# EAGLE board BSB-to-PoELAN (EAGLE 6.6.0)
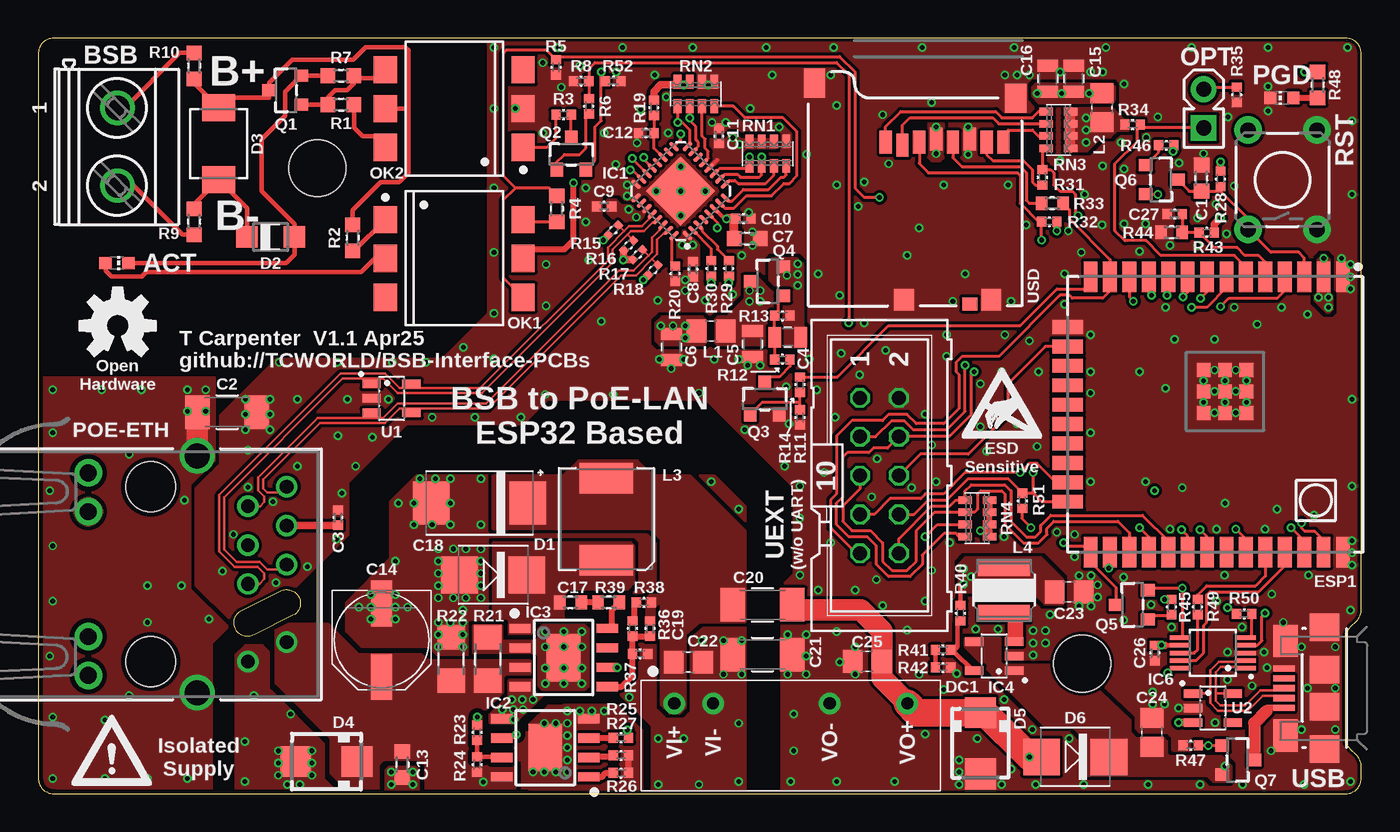
[diagram p4: board, top side]
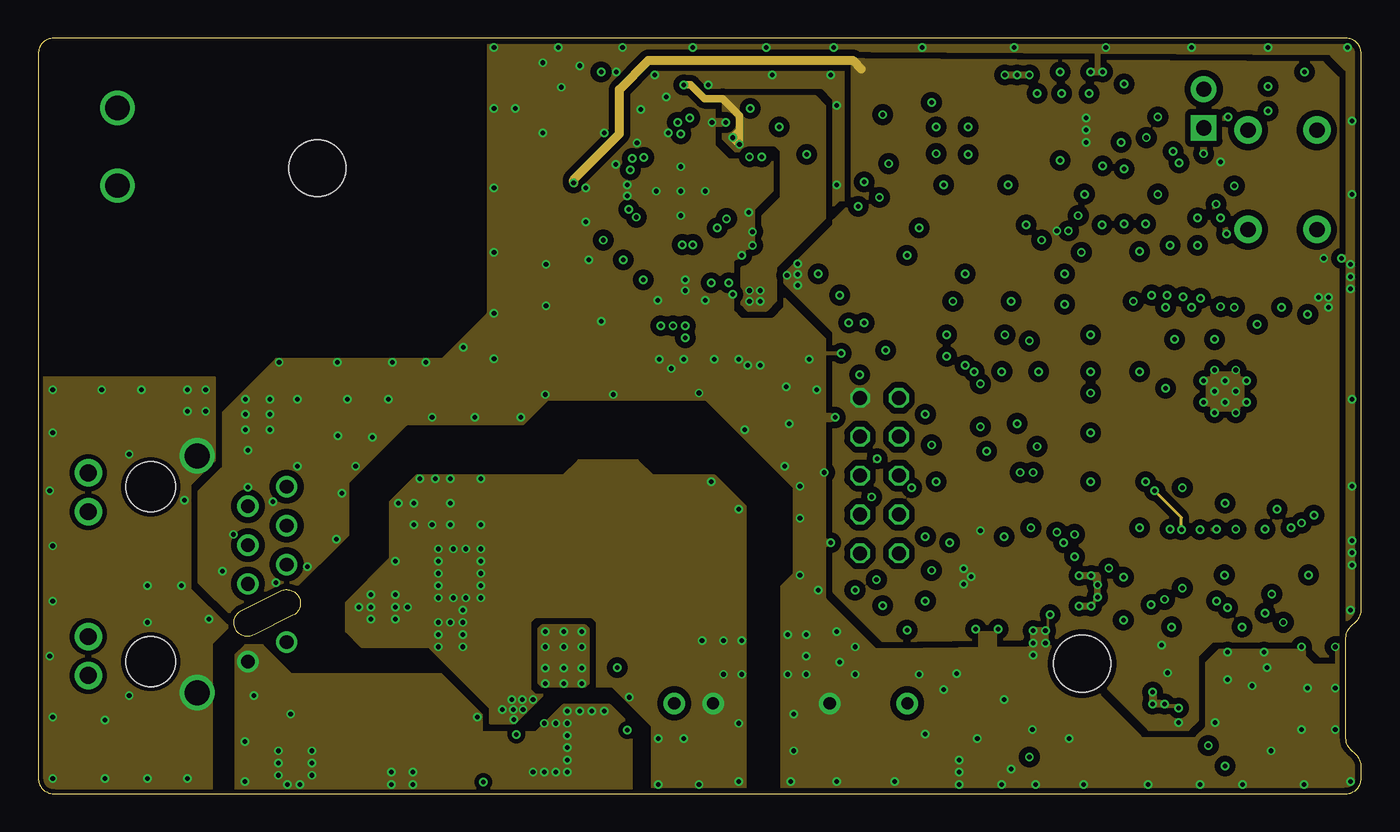
[diagram p5: board, inner layer Route2]
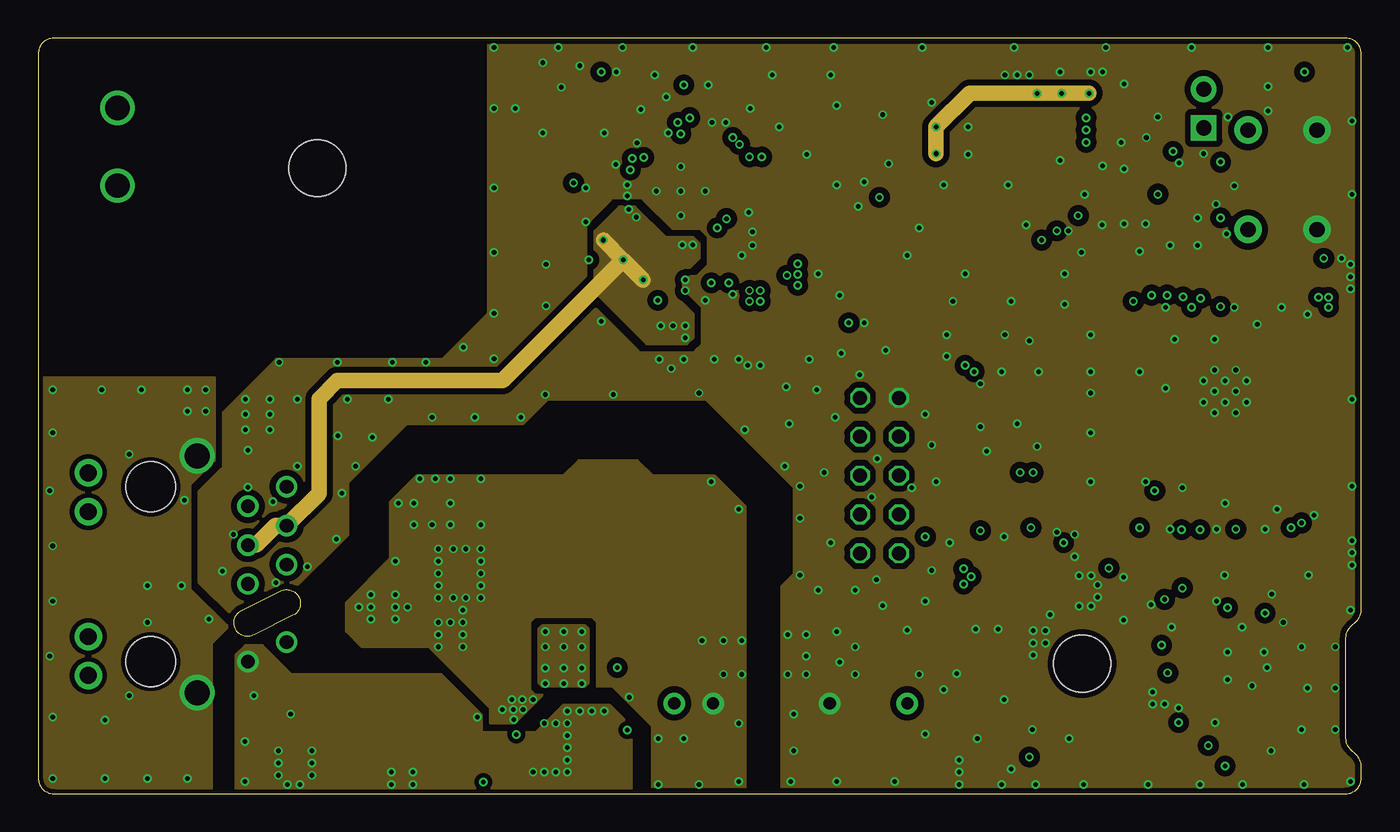
[diagram p6: board, inner layer Route15]
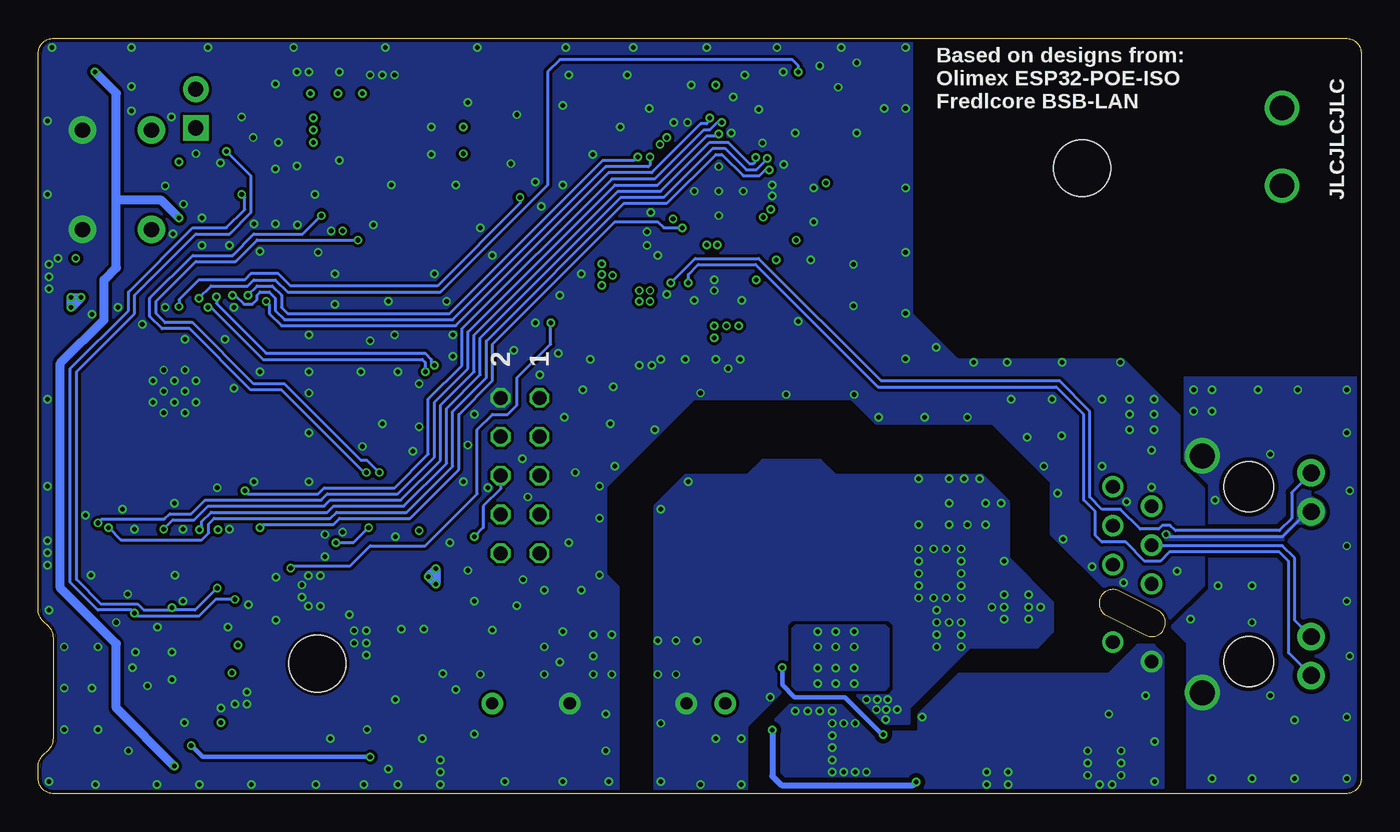
[diagram p7: board, bottom side, seen from below]

Size 86.5 x 49.4 mm. Coordinates in mm from the lower left corner, seen from the top.
Outline: 86.5,1 86.5,1.79 arc45 86.21,2.49 85.79,2.91 arc-45 85.5,3.61 85.5,10.19 arc-45 85.79,10.89 86.21,11.31 arc45 86.5,12.01 86.5,48.4 arc90 85.5,49.4 1,49.4 arc90 0,48.4 0,1 arc90 1,0 85.5,0 arc90 86.5,1
Copper layers (1+2*15+16): Top 0.035mm / dielectric 0.2mm / Route2 0.0175mm / dielectric 1.065mm / Route15 0.0175mm / dielectric 0.2mm / Bottom 0.035mm
Design rules "jlc4l-7628 *": minimum track width 0.12mm, minimum drill 0.2mm, track to track 0.125mm, track to pad 0.125mm, pad to pad 0.15mm, via to via 0.125mm, smd to smd 0mil, copper to edge 9mil, drill to drill 0.2mm, minimum pad ring 0.125mm, minimum via ring 0.125mm, stop-mask expansion 0.125mm, vias tented up to drill 1mm, thermal gap 6mil
Net classes: 1 100R: width 0.175 mm, drill 0.25 mm, clearance 0.15 mm; 2 PoE-ISO: clearance 2 mm to class 1; 3 B2B-ISO: clearance 2 mm to class 1, clearance 2 mm to class 2; 4 ESP32: clearance 2 mm to class 2, clearance 2 mm to class 3; 5 Sheild: clearance 1.5 mm to class 1, clearance 2 mm to class 2, clearance 2 mm to class 3, clearance 1.5 mm to class 4

## Footprints (pad centres in the part's own frame; a part is rotated, then mirrored left to right if it is on the bottom)
CHIP-LED0603 = smd 0.8 x 0.8: A 0,-0.75; C 0,0.75
MKDSN1_5-2-5_08 = drill 1.6: 1 -2.54,0.025; 2 2.54,0.025
C0603 = smd 0.95 x 1: 1 -0.85,0; 2 0.85,0
C1808 = smd 1.6 x 2.2: 1 -1.95,0; 2 1.95,0
C0402 = smd 0.6 x 0.65: 1 -0.5,0; 2 0.5,0
C0805L = smd 0.8 x 1.35: 1 -0.85,0; 2 0.85,0
PANASONIC_D = smd 3 x 1.4: + 2.4,0; - -2.4,0
C0603L = smd 0.75 x 0.9: 1 -0.7,0; 2 0.7,0
SMC_D = smd 2.4 x 2.8: + -3.15,0; - 3.15,0
C0805 = smd 1.3 x 1.5: 1 -0.95,0; 2 0.95,0
CNMB/3- = hole 3.7: 18.25,41.1; 68.25,8.7
SMB = smd 2.4 x 2.4: A 2.2,0; C -2.2,0
SOD123 = smd 1.4 x 1.4: A 1.55,0; C -1.55,0
SMBG = smd 1.78 x 2.16: 1 -2.35,0; 2 2.35,0
SMA = smd 2 x 2: A 2,0; C -2,0
SIP7-N = drill 0.8 pad 1.4: 1 -7.62,-0.5; 2 -5.08,-0.5; 5 2.54,-0.5; 7 7.62,-0.5
ESP32-WROOM-32UE = smd 2 x 0.9: 1 -9,16.51; 2 -9,15.24; 3 -9,13.97; 4 -9,12.7; 5 -9,11.43; 6 -9,10.16; 7 -9,8.89; 8 -9,7.62; 9 -9,6.35; 10 -9,5.08; 11 -9,3.81; 12 -9,2.54; 13 -9,1.27; 14 -9,0; 25 9,0; 26 9,1.27; 27 9,2.54; 28 9,3.81; 29 9,5.08; 30 9,6.35; 31 9,7.62; 32 9,8.89; 33 9,10.16; 34 9,11.43; 35 9,12.7; 36 9,13.97; 37 9,15.24; 38 9,16.51 | smd 0.9 x 2: 15 -5.715,-1.5; 16 -4.445,-1.5; 17 -3.175,-1.5; 18 -1.905,-1.5; 19 -0.635,-1.5; 20 0.635,-1.5; 21 1.905,-1.5; 22 3.175,-1.5; 23 4.445,-1.5; 24 5.715,-1.5 | smd 0.9 x 0.9: EP1 -1.5,8.79; EP2 -1.5,10.19; EP3 -0.1,10.19; EP4 -0.1,8.79; EP5 -0.1,7.39; EP6 -1.5,7.39; EP7 -2.9,7.39; EP8 -2.9,8.79; EP9 -2.9,10.19
QFN-5X5-32 = smd 0.75 x 0.25: 1 -2.375,1.75; 2 -2.375,1.25; 3 -2.375,0.75; 4 -2.375,0.25; 5 -2.375,-0.25; 6 -2.375,-0.75; 7 -2.375,-1.25; 8 -2.375,-1.75; 17 2.375,-1.75; 18 2.375,-1.25; 19 2.375,-0.75; 20 2.375,-0.25; 21 2.375,0.25; 22 2.375,0.75; 23 2.375,1.25; 24 2.375,1.75 | smd 0.25 x 0.75: 9 -1.75,-2.375; 10 -1.25,-2.375; 11 -0.75,-2.375; 12 -0.25,-2.375; 13 0.25,-2.375; 14 0.75,-2.375; 15 1.25,-2.375; 16 1.75,-2.375; 25 1.75,2.375; 26 1.25,2.375; 27 0.75,2.375; 28 0.25,2.375; 29 -0.25,2.375; 30 -0.75,2.375; 31 -1.25,2.375; 32 -1.75,2.375 | smd 3.2 x 3.2: EP 0,0
SOIC8-EP = smd 0.6 x 1.4: 1 -1.905,-2.85; 2 -0.635,-2.85; 3 0.635,-2.85; 4 1.905,-2.85; 5 1.905,2.85; 6 0.635,2.85; 7 -0.635,2.85; 8 -1.905,2.85 | smd 3.1 x 2.2: EP 0,0
DBV0005A-SOT23 = smd 0.55 x 1.2: 1 -0.95,-1.3; 2 0,-1.3; 3 0.95,-1.3; 4 0.95,1.3; 5 -0.95,1.3
MSOP10 = smd 0.3 x 1.3: 1 -1,-2.15; 2 -0.5,-2.15; 3 0,-2.15; 4 0.5,-2.15; 5 1,-2.15; 6 1,2.15; 7 0.5,2.15; 8 0,2.15; 9 -0.5,2.15; 10 -1,2.15
L2010 = smd 1.3 x 1.5: 1 -0.95,0; 2 0.95,0
L6560P = smd 2 x 3.5: 1 -2.675,0; 2 2.675,0
L4040P = smd 1.1 x 3.4: 1 -1.5,0; 2 1.5,0
DIL6-SMD = smd 1.78 x 1.52: 1 -2.54,-4.5; 2 0,-4.5; 3 2.54,-4.5; 4 2.54,4.5; 5 0,4.5; 6 -2.54,4.5
1X02 = drill 1 pad 1.676 square: 1 -1.27,0 | drill 1 pad 1.676: 2 1.27,0
HY931147C-SLOT = drill 0.89 pad 1.4: 1 5.715,-8.89; 2 4.445,-6.35; 3 3.175,-8.89; 4 1.905,-6.35; 5 0.635,-8.89; 6 -0.635,-6.35; 9 -4.445,-8.89; 10 -5.715,-6.35 | drill 1.1 pad 1.8: 11 6.625,4.08; 12 4.085,4.08; 13 -4.085,4.08; 14 -6.625,4.08 | drill 1.63 pad 2.3: SH1 7.745,-3.05; SH2 -7.745,-3.05 | hole 3.25: -5.715,0; 5.715,0
SOT23 = smd 0.8 x 0.9: 1 -0.95,-1; 2 0.95,-1; 3 0,1.1
SOT23-BEC = smd 0.8 x 0.9: B -0.95,-1; C 0,1.1; E 0.95,-1
R0603 = smd 0.95 x 1: 1 -0.85,0; 2 0.85,0
R0402 = smd 0.6 x 0.65: 1 -0.5,0; 2 0.5,0
R0402L = smd 0.47 x 0.52: 1 -0.45,0; 2 0.45,0
R1206 = smd 1.6 x 1.803: 1 -1.422,0; 2 1.422,0
R0603L = smd 0.75 x 0.9: 1 -0.7,0; 2 0.7,0
CTS742C083 = smd 0.5 x 0.9: 1 -1.2,-0.8; 2 -0.4,-0.8; 3 0.4,-0.8; 4 1.2,-0.8; 5 1.2,0.8; 6 0.4,0.8; 7 -0.4,0.8; 8 -1.2,0.8
TACTILE_SWITCH = drill 1 pad 1.8: 1 -3.25,2.25; 2 3.25,2.25; 3 -3.25,-2.25; 4 3.25,-2.25
ML10 = drill 0.914 octagon: 1 -5.08,-1.27; 2 -5.08,1.27; 3 -2.54,-1.27; 4 -2.54,1.27; 5 0,-1.27; 6 0,1.27; 7 2.54,-1.27; 8 2.54,1.27; 9 5.08,-1.27; 10 5.08,1.27
USB-MICROB = smd 0.4 x 1.4: D+ 0,2.65; D- -0.65,2.65; GND 1.3,2.65; ID 0.65,2.65; VBUS -1.3,2.65 | smd 1.8 x 1.9: MT1 -4,0; MT2 4,0; MT5 -1.2,0; MT6 1.2,0 | smd 2.1 x 1.6: MT3 -3.1,2.55; MT4 3.1,2.55
MICRO-SD = smd 0.8 x 1.5: 1 5.35,-4.8; 2 6.45,-5; 3 7.55,-4.8; 4 8.65,-4.6; 5 9.75,-4.8; 6 10.85,-4.6; 7 11.95,-4.8; 8 13.05,-4.8 | smd 1 x 0.85: 9 10.86,-15.375 | smd 1.4 x 1.9: S1 0.7,-0.95; S2 13.85,-1.92 | smd 1.3 x 1.4: S3 6.55,-15.1; S4 12.25,-15.1

## Placement (x,y rotation side)
ACT  red  [CHIP-LED0603]  5.15,34.7 270 top
BSB  MKDSN1,5/2-5,08  [MKDSN1_5-2-5_08]  5.15,42.3 270 top
C1  2.2uF  [C0603]  76.05,40.25 90 top
C2  1nF 3kV  [C1808]  12.35,24.95 0 top
C3  0.1uF  [C0402]  19.6,18.05 90 top
C4  22uF  [C0805L]  49,29.85 180 top
C5  22uF  [C0805L]  46.7,29.4 270 top
C6  22uF  [C0805L]  41.4,29.2 270 top
C7  2.2uF  [C0603]  46.35,36.3 0 top
C8  0.1uF  [C0402]  42.8,34.3 270 top
C9  0.1uF  [C0402]  37,38.4 180 top
C10  0.1uF  [C0402]  46.1,37.6 0 top
C11  0.1uF  [C0402]  44.5,43 90 top
C12  0.1uF  [C0402]  39.75,43.2 180 top
C13  0.1uF 100V  [C0603]  23.8,1.9 270 top
C14  22uF 100V  [PANASONIC_D]  22.45,10.05 270 top
C15  22uF  [C0805L]  67.7,46.75 90 top
C16  22uF  [C0805L]  66,46.75 90 top
C17  0.1uF  [C0603L]  34.8,12.5 180 top
C18  470uF 10V  [SMC_D]  28.85,19 180 top
C19  12pF  [C0402]  40,10.8 270 top
C20  1nF 3kV  [C1808]  47.35,12.35 0 top
C21  1nF 3kV  [C1808]  47.35,9.1 0 top
C22  22uF  [C0805]  42.5,8.6 0 top
C23  22uF  [C0805]  67.4,13.2 0 top
C24  22uF  [C0805]  72.8,4 90 top
C25  22uF  [C0805]  54.2,8.65 180 top
C26  0.1uF  [C0402]  73,9.2 270 top
C27  0.1uF  [C0402]  74.3,37.9 180 top
CASE1  DNI  [CNMB/3-]  0,-0.2 0 top
D1  SS510B  [SMB]  29.75,14.3 180 top
D2  1N4148W  [SOD123]  15.2,36.4 0 top
D3  24V  [SMBG]  11.8,42.5 90 top
D4  58V  [SMA]  18.85,2.1 180 top
D5  6V  [SMA]  61.6,3.3 270 top
D6  SS510B  [SMB]  67.8,2.4 180 top
DC1  F0505S-2WR2SC  [SIP7-N]  49.2,6.4 0 top
ESP1  ESP32-WROOM-32UE  [ESP32-WROOM-32UE]  68.8,24.8 270 top
IC1  LAN8710A-EZC  [QFN-5X5-32]  42,39.4 135 top
IC2  TPS2376DDA  [SOIC8-EP]  33.15,3 90 top
IC3  TX4138  [SOIC8-EP]  34.35,8.9 270 top
IC4  SY8089AAAC  [DBV0005A-SOT23]  62.5,9 90 top
IC6  CH340X  [MSOP10]  76.8,9.2 90 top
L1  FB 600R  [L2010]  44,30.25 180 top
L2  FB 600R  [L2010]  69.55,44.85 90 top
L3  33uH 2.5A  [L6560P]  37.15,17.95 90 top
L4  2.2uH 1.5A  [L4040P]  63.15,13.3 90 top
OK1  4N25SM  [DIL6-SMD]  27.2,35 270 top
OK2  4N25SM  [DIL6-SMD]  27.2,44.8 90 top
OPT  DNI  [1X02]  76.2,44.8 90 top
PGD  red  [CHIP-LED0603]  81.3,45.5 90 top
POE-ETH  HY931147C-SLOT  [HY931147C-SLOT]  7.35,14.35 90 top
Q1  BC847  [SOT23]  16.2,46 90 top
Q2  BC857  [SOT23-BEC]  34.85,41.8 0 top
Q3  BC847  [SOT23]  47.5,25.8 0 top
Q4  WPM2015-3/TR  [SOT23]  47.7,33.5 90 top
Q5  BC847  [SOT23]  71.55,12.35 90 top
Q6  BC847  [SOT23]  73.4,40.15 270 top
Q7  WPM2015-3/TR  [SOT23]  78.4,2.2 270 top
R1  330k  [R0603]  19.8,45.05 0 top
R2  1.5k  [R0603]  20.55,36.35 270 top
R3  220R  [R0402]  34.35,44.4 180 top
R4  330k  [R0603]  33.9,38.25 270 top
R5  4.7k  [R0402]  33.85,47.5 270 top
R6  4.7k  [R0402]  36,44.95 90 top
R7  330k  [R0603]  19.8,46.95 0 top
R8  4.7k  [R0402]  35.5,46.6 0 top
R9  10R  [R0603]  10.2,37.4 90 top
R10  10R  [R0603]  10.2,47.6 270 top
R11  10k  [R0402]  49.8,24.6 270 top
R12  1k  [R0402]  48.65,28.4 180 top
R13  10k  [R0402]  48.65,31.25 0 top
R14  10k  [R0402]  49.8,26.75 270 top
R15  49.9R  [R0402L]  37.6,36.85 225 top
R16  49.9R  [R0402L]  38.6,35.85 45 top
R17  49.9R  [R0402L]  39.2,35.25 225 top
R18  49.9R  [R0402L]  40.2,34.25 45 top
R19  10k  [R0402]  40.25,44.85 90 top
R20  12.1k 1%  [R0402]  41.65,34 90 top
R21  0.03R 1%  [R1206]  29.4,8.8 90 top
R22  DNI  [R1206]  27,8.8 90 top
R23  12.1k 1%  [R0402]  28.7,4 90 top
R24  180k 1%  [R0402]  28.7,1.9 90 top
R25  28.7k 1%  [R0402]  38.1,3.65 180 top
R26  180k 1%  [R0402]  38.1,1.35 0 top
R27  4.42k 1%  [R0402]  38.1,2.5 0 top
R28  10k  [R0402]  77.3,40.2 90 top
R29  220R  [R0402]  45.15,34.35 90 top
R30  220R  [R0402]  44,34.35 90 top
R31  220R  [R0402]  65.65,40.3 270 top
R32  10k  [R0402]  66.1,37.4 0 top
R33  10R  [R0603L]  66.3,38.6 180 top
R34  10k  [R0402]  71.55,43.75 180 top
R35  220R  [R0402]  78.35,45.7 270 top
R36  12.1k 1%  [R0402]  38.85,10.8 90 top
R37  4.42k 1%  [R0402]  39.35,9.15 0 top
R38  12.1k 1%  [R0402]  39.6,12.5 180 top
R39  10R  [R0603L]  37.3,12.5 180 top
R40  180k 1%  [R0402]  60.3,11.8 90 top
R41  12.1k 1%  [R0402]  59.15,9.4 0 top
R42  28.7k 1%  [R0402]  59.15,8.25 0 top
R43  180k 1%  [R0402]  76.4,36.7 180 top
R44  330k  [R0603L]  74.1,36.7 180 top
R45  1k  [R0402]  74.1,12.2 90 top
R46  1k  [R0402]  73.75,42.4 0 top
R47  10k  [R0402]  75.35,3.15 180 top
R48  1.5k  [R0603]  83.65,46.35 90 top
R49  220R  [R0402]  75.8,12.2 90 top
R50  4.7k  [R0402]  78.85,11.75 0 top
R51  220R  [R0402]  64.35,19.15 90 top
R52  4.7k  [R0402]  37.6,46.6 180 top
RN1  2.2k  [CTS742C083]  47.7,41.85 0 top
RN2  2.2k  [CTS742C083]  43,45.75 0 top
RN3  2.2k  [CTS742C083]  66.7,43.4 270 top
RN4  2.2k  [CTS742C083]  61.4,18 270 top
RST  Tact 19mm  [TACTILE_SWITCH]  81.35,40.14 90 top
U1  ESDS314DBV  [DBV0005A-SOT23]  23.1,25.85 270 top
U2  ESDS314DBV  [DBV0005A-SOT23]  76.8,5.6 270 top
U$1  [WARN-TINY]  4.8,2.3 0 top
U$2  [ESD-TINY]  63,25 0 top
U$3  DNI  [OSHW-LOGO-M]  5.2,30.6 0 top
UEXT  2x5 IDC  [ML10]  55,20.8 270 top
USB  ZX62-B-5PA(33)  [USB-MICROB]  84.1,6.9 90 top
USD  XKTF-001A  [MICRO-SD]  50.05,47.4 0 top

## Tracks (layer width: path | path; a pad name or v marks a point on that pad's centre or on a via)
3V3-FB
  Top 0.3: R40.1 60.1,11.1 60.1,9.6 59.9,9.4 | 59.9,9.4 R41.2 | IC4.5 61.1,8.05 59.9,9.25 59.9,9.4
3V3-FB-RB
  Top 0.3: R41.1 R42.1
3V3-LX
  Top 0.55: IC4.3 63.9,9.95 63.9,10.2
  Top 1: 63.9,10.2 63.9,11.8 L4.1
+3.3V  (via drill 0.3)
  Top 0.2: IC6.10 74.15,8.2 v73.85,7.9
  Top 0.3: R40.2 60.3,13.7 v60.5,13.7 | IC6.7 73.65,9.7
  Top 0.4: OK1.5 31.7,35.6 34.4,35.6 35,36.2 v35,39.95 | RN4.8 RN4.7 RN4.6 62.2,17.2 | 62.2,17.2 RN4.5 | v61.6,17.2 62.2,17.2
  Top 0.5: R32.2 v66.6,36.8 | 73.65,9.7 v73.45,9.7 C26.1 | U2.3 v74.55,4.65 | R28.2 v77.3,41.3
  Top 0.6: RN3.5 RN3.6 RN3.7 RN3.8
  Route2 0.6: v35,39.95 35,40.15 38,43.15 38,46.05 39.9,47.95 53.25,47.95 53.8,47.4
  Bottom 0.6: v83.7,32.45 v84.35,31.8 v84.35,32.45 v83.7,32.45 | v60.5,14.7 v60.5,13.7 v61,14.2 v60.5,14.7
  other vias: 84.05,35 68.5,44.2 68.5,43.4 68.5,42.6 49.65,34.65 49.65,33.25 48.95,33.9 49.65,33.95
  pour Top (isolate 0.2, no thermals): 60.4,13.2 65,13.2 65.8,12.4 67,12.4 67,14 65.6,15.4 60.6,15.4 60.2,15 60.2,13.4
  pour Route2 (isolate 0.4, rank 4, no thermals): 84,47.8 54,48 53.2,48 53.2,38.6 48.8,34.4 48.8,33.4 52,30.2 52,13.2 55.2,10 68.8,10.2 69.4,9.6 69.4,7.4 72.6,4.2 75.2,4.2 75.8,4.8 75.8,9 76.8,10 82.8,10 83.8,9 84.4,9 85,9.6 85,46.8
  pour Top (isolate 0.2, no thermals): 84.6,31.65 84.6,32.55 84.45,32.7 84.45,34.9 84.15,35.2 83.95,35.2 83.65,34.9 83.65,32.75 83.45,32.55 83.45,32.25 84.2,31.5 84.45,31.5
  pour Top (isolate 0.2, no thermals): 67.15,42.05 68.6,42.05 69.5,42.95 70.1,42.95 70.55,43.4 71.3,43.4 71.3,44.05 71,44.05 70.25,44.8 67.15,44.8
  pour Top (isolate 0.2, no thermals): 50,30.6 50,34.6 49.6,35 48,35 47.8,34.8 47.8,33.6 48.6,32.8 48.6,29.25 50.2,29.25 50.2,30.4
+5.0V  (via drill 0.3)
  Top 0.5: R43.1 76.9,37.25 v77.3,37.65
  Top 0.6: v82.8,47.2 R48.2
  Bottom 0.6: v77.6,1.8 81.4,5.6 81.4,9.8 85.05,13.45 85.05,28.15 82.2,31 82.2,33.6 81.4,34.4 81.4,38.8 | 81.4,38.8 81.4,45.8 v82.8,47.2 | v77.3,37.65 78.45,38.8 81.4,38.8
  pour Top (isolate 0.2, no thermals): 73.6,3.6 71.8,3.6 71.4,4 71.4,4.8 67.6,8.4 63.1,8.4 62.9,8.6 62.9,10.15 60.6,10.15 60.6,9.6 65.8,4.4 67.6,4.4 68.6,3.4 68.6,1.2 76.4,1.2 76.8,0.8 77.8,0.8 78,1 78,1.8 77.4,2.4 74,2.4 73.8,2.6 73.8,3.4
+5.0V-POE  (via drill 0.3)
  Top 0.2: R47.1 v76.5,3.15 Q7.1
  Top 1.4: DC1.7 55.15,7.57 C25.1 55.15,10.65 53.8,12 49.3,12 C20.2
  Top 1.8: D6.A v64.8,2.4 61.9,5.3 D5.C 57.42,5.3 DC1.7
  Bottom 0.3: v64.8,2.4 75.75,2.4 v76.5,3.15
BSB+
  Top 0.3: R10.2 10.2,46.45 D3.2 11.8,45.5 15.1,45.5 Q1.3 15.1,46.5 16.6,48 20.6,48 21.4,48.8 24,48.8 24.2,48.6 24.2,44.8 | 24.2,44.8 24.2,40.6 23.6,40 22.4,40 20.55,38.15 R2.1 | OK2.5 24.2,44.8
BSB-
  Top 0.3: ACT.C 16.2,34.7 16.75,35.25 D2.A 16.75,37.25 14.6,39.4 14.6,42.8 16.15,44.35 16.15,45.9 Q1.2 R7.1
BSB-ENB  (via drill 0.3)
  Top 0.2: ESP1.8 76.42,32.82 v76,32.4 | Q2.E 36.4,41.4 36.4,43.6 36.8,44 36.8,46.6 | R52.2 36.8,46.6 | 36.8,46.6 v36.8,47.2
  Bottom 0.2: v76,32.4 75.2,33.2 72.8,33.2 72.4,33.6 71,33.6 70.2,32.8 60.2,32.8 53.2,39.8 53.2,47.2 52.4,48 37.2,48 36.8,47.6 v36.8,47.2
BSB-RX-A
  Top 0.3: OK1.1 20.66,35.5 R2.2
BSB-RX-K
  Top 0.3: ACT.A 4.4,34.2 4.8,33.8 6.75,33.8 7.05,34.1 21.1,34.1 22,35 OK1.2
BSB-RXD  (via drill 0.3)
  Top 0.2: 31.2,39.6 30.4,40.4 30.4,48.4 30.6,48.6 33.25,48.6 R5.1 33.85,48.2 52.4,48.2 53.4,47.2 53.4,39.6 54,39 v55,39 | 31.2,39.6 30.4,38.8 30.4,33.76 OK1.4 | R4.1 33.4,39.6 31.2,39.6 | v77.3,31.85 77.85,32.4 81,32.4 81.5,32.9 ESP1.4
  Bottom 0.2: v55,39 55,38.6 60.4,33.2 70,33.2 70.8,34 72.6,34 73,33.6 76,33.6 77.3,32.3 v77.3,31.85
BSB-TX-B
  Top 0.3: R1.2 20.65,43.55 21.2,43 22.7,43 OK2.6
BSB-TX-E
  Top 0.3: OK2.4 22.7,46.8 20.65,46.8 R7.2 20.65,46.45 20.2,46 19.4,46 18.95,45.55 R1.1 Q1.1
BSB-TXD  (via drill 0.3)
  Top 0.2: ESP1.26 70.07,14.82 v70,14.75 | v53,30.8 53,47 52.2,47.8 36.4,47.8 36,47.4 R8.2 R6.2
  Bottom 0.2: v70,14.75 69.85,14.9 66.1,14.9 64.8,16.2 61.2,16.2 57.8,19.6 57.8,23.8 56.8,24.8 55.8,24.8 55.2,25.4 55.2,27.2 53,29.4 v53,30.8
CH340-!CTS
  Top 0.2: IC6.5 79.35,10.2 R50.2
CH340-!DTR  (via drill 0.3)
  Top 0.2: IC6.6 74.8,10.2 v74.8,13.45 72.55,13.45 Q5.2 | v77.75,12.15 77.95,12.15 R50.1 | R46.2 74.25,42.05 v74.2,42
  Bottom 0.2: v74.8,13.45 76.25,12 77.75,12 | 77.75,12 v77.75,12.15 | 77.75,12 79.6,12 80,12.4 82.4,12.4 84,14 84,27.6 80.2,31.4 80.2,32.6 76.2,36.6 74,36.6 72.6,38 72.6,40.4 v74.2,42
CH340-!RTS  (via drill 0.3)
  Top 0.2: IC6.4 79.7,9.7 80,10 80,11.6 v80.2,11.8 | R45.2 v73.65,12.7 | Q6.2 v73.2,39.2
  Bottom 0.2: v73.65,12.7 74.9,12.7 76,11.6 80,11.6 v80.2,11.8 80.4,12 82.6,12 84.4,13.8 84.4,27.8 80.6,31.6 80.6,32.8 76.4,37 74.2,37 73,38.2 73,39 v73.2,39.2
CH340-TXD
  Top 0.2: IC6.8 75.6,9.2 75.8,9.4 R49.1
CON-BSB+
  Top 0.3: R10.1 9.25,48.45 5.64,44.84 BSB.1
CON-BSB-
  Top 0.3: R9.1 9.45,36.55 6.24,39.76 BSB.2
EMAC-CLKOUT  (via drill 0.3)
  Top 0.2: ESP1.28 72.61,16.79 v72,17.4 | IC1.5 44.4,37.35 v44.4,37
  Bottom 0.2: v72,17.4 71.8,17.6 67.2,17.6 66.8,18 62.2,18 59,21.2 59,24.8 56.8,27 56.8,29.4 48.8,37.4 46,37.4 45.6,37 v44.4,37
EMAC-MDC  (via drill 0.3)
  Top 0.2: ESP1.37 84.04,16.56 83.45,17.15 82.8,17.15 82.6,17.35 v82.6,17.7 | IC1.17 42,42.76 v42,43.15
  Bottom 0.2: v82.6,17.7 82.35,17.95 78.25,17.95 77.9,18.3 76.5,18.3 75.6,19.2 68,19.2 67.6,19.6 63,19.6 60.6,22 60.6,25.6 58.4,27.8 58.4,30.2 48.8,39.8 46,39.8 42.8,43 42.15,43 v42,43.15
EMAC-MDIO  (via drill 0.3)
  Top 0.2: ESP1.30 75.15,16.85 v74.75,17.25 | IC1.16 42.6,42.47 42.6,43.4 42.1,43.9 v41.8,43.9 RN2.1
  Route2 0.2: v74.75,17.25 74.75,18.05 v73,19.8
  Bottom 0.2: v73,19.8 72.8,19.6 68.2,19.6 67.8,20 63.2,20 61,22.2 61,25.8 58.8,28 58.8,30.4 49,40.2 46.2,40.2 43,43.4 42.6,43.4 42.1,43.9 v41.8,43.9
EMAC-RX-CRSDV  (via drill 0.3)
  Top 0.2: ESP1.12 71.34,32.46 v71.6,32.2 | IC1.15 43.15,42.32 43.15,42.6 43,42.75 43,43.6 42.6,44 v42.6,44.2 RN2.2
  Bottom 0.2: v71.6,32.2 71.4,32 71.4,31.4 70.6,30.6 59.2,30.6 49.2,40.6 46.4,40.6 43.2,43.8 42.8,43.8 42.6,44 v42.6,44.2
EMAC-RXD0  (via drill 0.3)
  Top 0.2: ESP1.10 73.88,32.68 v73.8,32.6 | IC1.11 44.56,40.9 46.5,40.9 RN1.1 v46.5,41.65
  Bottom 0.2: v73.8,32.6 73.65,32.6 73.05,32 72.5,32 72.2,32.3 72.2,32.6 72,32.8 71.4,32.8 71,32.4 71,31.6 70.4,31 59.4,31 49.4,41 46.6,41 46.5,41.1 v46.5,41.65
EMAC-RXD1  (via drill 0.3)
  Top 0.2: ESP1.11 72.61,32.79 v72.8,32.6 | IC1.10 44.87,40.5 45.7,40.5 45.9,40.3 47.15,40.3 47.3,40.45 RN1.2 v47.3,41.65
  Bottom 0.2: v72.8,32.6 72.2,33.2 71.2,33.2 70.6,32.6 70.6,31.8 70.2,31.4 59.6,31.4 49.6,41.4 47.55,41.4 v47.3,41.65
EMAC-TXD0  (via drill 0.3)
  Top 0.2: ESP1.31 76.42,16.78 v75.95,17.25 | v38.85,41.55 38.79,41.55 IC1.22
  Bottom 0.2: v75.95,17.25 75.8,17.4 75.8,17.8 75.2,18.4 67.6,18.4 67.2,18.8 62.6,18.8 59.8,21.6 59.8,25.2 57.6,27.4 57.6,29.8 48.4,39 45.6,39 42.4,42.2 41.6,42.2 40.2,40.8 39.55,40.8 38.8,41.55 v38.85,41.55
EMAC-TXD1  (via drill 0.3)
  Top 0.2: ESP1.36 82.77,16.53 v81.9,17.4 | v38.7,40.8 38.83,40.8 IC1.23
  Bottom 0.2: v81.9,17.4 81.1,16.6 75.8,16.6 75.35,17.05 75.35,17.65 75,18 67.4,18 67,18.4 62.4,18.4 59.4,21.4 59.4,25 57.2,27.2 57.2,29.6 48.2,38.6 45.4,38.6 42.2,41.8 41.8,41.8 40.4,40.4 39.35,40.4 38.95,40.8 v38.7,40.8
EMAC-TXEN  (via drill 0.3)
  Top 0.2: ESP1.33 78.96,16.64 v78.3,17.3 | v39.6,41.6 39.6,41.45 IC1.21
  Bottom 0.2: v78.3,17.3 77.7,17.9 76.3,17.9 75.4,18.8 67.8,18.8 67.4,19.2 62.8,19.2 60.2,21.8 60.2,25.4 58,27.6 58,30 48.6,39.4 45.8,39.4 42.6,42.6 41.4,42.6 40,41.2 39.75,41.2 39.6,41.35 v39.6,41.6
ESP-BUTTON
  Top 0.2: ESP1.6 78.96,34.44 78.2,35.2 73.4,35.2 72.45,36.15 71.05,36.15 70.4,36.8 70.4,41.2 71.85,42.65 71.85,43.55 72.05,43.55 | R34.1 72.05,43.55 | OPT.1 76.2,43.55 72.05,43.55
ESP-BUTTON-R
  Top 0.2: OPT.2 76.2,46.2 R35.1
ESP-EN
  Top 0.2: ESP1.3 82.77,35.03 82.4,35.4 80.59,35.4 RST.1 79.1,37.6 77.3,39.4 | Q6.3 75.25,39.4 C1.1 77.3,39.4 | 77.3,39.4 R28.1
ESP-EN-OE
  Top 0.2: Q6.1 73.25,41.95 R46.1
ESP-GPIO0  (via drill 0.3)
  Top 0.2: Q5.3 70.45,13.5 68.8,15.15 ESP1.25 68.8,16.2 67.25,16.2 v67.05,16.4 | R51.1 64.3,18.65 64.3,18 v64.9,17.4
  Bottom 0.2: v64.9,17.4 65.9,16.4 v67.05,16.4
ESP-GPIO0-OE
  Top 0.2: Q5.1 72.55,11.65 74.1,11.65 R45.1
ESP-RXD
  Top 0.2: R49.2 75.8,13 76.4,13.6 79.6,13.6 80.23,14.23 ESP1.34
ESP-SCL
  Top 0.2: UEXT.5 53.73,19.93 52.6,18.8 52.6,17.8 53.2,17.2 54.4,17.2 55.2,16.4 55.2,15.2 55.8,14.6 56.8,14.6 57.4,15.2 57.4,17.2 58.6,18.4 RN4.2 61.2,18.4 61.4,18.6 61.4,19.6 61.6,19.8 63,19.8 63.2,19.6 63.2,17.6 64.4,16.4 65.4,16.4 65.95,16.95 65.95,17.35 66.4,17.8 70.6,17.8 71.34,17.06 ESP1.27
ESP-SD-CLK
  Top 0.2: UEXT.9 53.48,15.72 51.8,17.4 51.8,19.2 52.2,19.6 52.2,23.4 53.2,24.4 55.2,24.4 55.6,24.8 56.8,24.8 57.4,24.2 59.2,24.2 60.2,25.2 60.2,27.4 60,27.6 60,28.2 60.4,28.6 62.8,28.6 66.8,32.6 67.4,32.6 67.6,32.4 69.6,32.4 70.07,32.87 ESP1.13 70.07,34.93 67.4,37.6 67.4,38.2 R33.1
ESP-SD-CMD  (via drill 0.3)
  Top 0.2: UEXT.7 54.66,18.26 55.7,19.3 57.7,19.3 58,19.6 59.2,19.6 60.6,21 v64.2,21 64.8,21.6 65.3,21.6 66.55,20.36 ESP1.23 | USD.3 57.6,41.2 58.2,40.6 64,40.6 64.2,40.4 64.2,38.6 65.4,37.4 R32.1 v65.6,36.2
  Bottom 0.2: v64.2,21 65,21.8 65.4,21.8 70.4,26.8 72.4,26.8 76.4,30.8 78.2,30.8 78.8,31.4 78.8,32.2 76.2,34.8 73.6,34.8 72.2,36.2 v65.6,36.2
ESP-SD-DATA  (via drill 0.3)
  Top 0.2: UEXT.8 57.26,18.26 58.2,19.2 59.4,19.2 60.8,20.6 63.4,20.6 R51.2 65.05,19.65 | RN3.4 65.65,42.2 R31.1 66.2,40.8 66.4,40.6 66.4,39.8 66.8,39.4 67.6,39.4 67.8,39.2 67.8,38 v68,37.8 | ESP1.24 65.61,19.09 65.05,19.65 | 65.05,19.65 v65.05,21
  Bottom 0.2: v65.05,21 65.2,21 70.6,26.4 72.6,26.4 76.6,30.4 78.4,30.4 79.2,31.2 79.2,32.4 76.4,35.2 73.8,35.2 72.4,36.6 69.2,36.6 v68,37.8
ESP-SDA  (via drill 0.3)
  Top 0.2: ESP1.16 65.84,29.25 63.4,26.8 63.4,24.8 60.8,22.2 57.67,22.2 UEXT.6 | v58,16.8 58.8,17.6 RN4.3
  Bottom 0.2: UEXT.6 56.27,19.93 57.4,18.8 57.4,17.4 v58,16.8
ESP-SSEL
  Top 0.2: UEXT.10 56.27,16.67 58.4,18.8 59.6,18.8 60,19.2 RN4.1 60.6,19.8 61,20.2 63.2,20.2 63.6,19.8 63.6,17.8 64.6,16.8 65.2,16.8 65.55,17.15 65.55,17.55 66.2,18.2 72.2,18.2 73.88,16.52 ESP1.29
ESP-TXD
  Top 0.2: IC6.9 75.7,8.7 76.2,9.2 76.2,11 76.4,11.2 76.4,13 76.6,13.2 79.8,13.2 81.5,14.9 ESP1.35
ETH-LED1
  Top 0.2: IC1.3 43.4,36.94 43.4,36.8 44.4,35.8 44.4,35.6 R29.2
ETH-LED1-A  (via drill 0.3)
  Top 0.2: R29.1 v45.15,33.4
  Bottom 0.2: POE-ETH.11 4.55,19.7 4.55,18 5.35,17.2 12.15,17.2 12.5,17.55 13,17.55 13.25,17.3 14.45,17.3 15.75,18.6 16.95,18.6 17.75,19.4 17.75,25 19.75,27 31.4,27 39.4,35 43.55,35 v45.15,33.4
ETH-LED2
  Top 0.2: IC1.2 44,35.63 R30.2
ETH-LED-G-K  (via drill 0.3)
  Top 0.2: R30.1 v44,33.4
  Bottom 0.2: POE-ETH.14 4.75,9.21 4.75,15.2 5.35,15.8 12.55,15.8 13.15,15.2 14.15,15.2 15.4,16.45 16.95,16.45 17.4,16.9 17.4,18.45 18.15,19.2 18.15,24.8 19.95,26.6 31.6,26.6 39.6,34.6 43.35,34.6 44,33.95 v44,33.4
ETH-PHYAD0
  Top 0.2: IC1.13 43.8,41.55 43.8,42 43.6,42.2 43.6,42.8 43.4,43 RN2.3
ETH-PHYAD1
  Top 0.2: IC1.7 44.87,38.3 45.5,38.3 46.3,39.1 47.95,39.1 48.75,39.9 49.1,39.9 49.6,40.4 49.6,43.3 48.7,44.2 46.2,44.2 45.45,44.95 RN2.4
ETH-PHYAD2
  Top 0.2: IC1.8 45.12,38.75 45.35,38.75 46.1,39.5 47.75,39.5 48.55,40.3 48.75,40.3 48.9,40.45 RN1.4
ETH-PWR-B
  Top 0.2: Q3.1 47.35,25.6 49.8,25.6 | R11.1 49.8,25.6 | 49.8,25.6 R14.2
ETH-PWR-C
  Top 0.2: R12.1 49.15,27.95 48.45,27.25 47.5,27.25 Q3.3
ETH-PWR-G
  Top 0.2: Q4.1 48.35,32.55 48.35,31.25 R13.1 C4.2 R12.2
ETH-RBIAS
  Top 0.2: IC1.32 41.4,36.32 41.4,34.75 R20.2
ETH-RD_N
  Top 0.175: POE-ETH.2 14.49,18.8 14.78,19.08 14.78,19.44 14.39,19.83 14.39,20.67 18.28,24.56 21.8,24.56 | R17.1 39.9,35.18 | 39.9,35.18 38.93,34.21 37.98,34.21 29.28,25.51 23.48,25.51 22.53,24.56 21.8,24.56 | IC1.30 40.63,36.97 40.63,36.86 40.14,36.37 40.14,35.42 39.9,35.18 | U1.3 21.8,24.56
ETH-RD_P
  Top 0.175: POE-ETH.1 15.88,19.7 14.98,19.7 14.71,19.97 14.71,20.53 18.42,24.24 22.67,24.24 23.62,25.19 24.4,25.19 | R18.2 40.13,34.95 | 40.13,34.95 39.07,33.89 38.12,33.89 29.42,25.19 24.4,25.19 | IC1.31 41,36.63 40.87,36.63 40.46,36.23 40.46,35.28 40.13,34.95 | U1.4 24.4,25.19
ETH-RMIISEL
  Top 0.2: IC1.9 45.17,40.1 45.55,40.1 45.75,39.9 47.55,39.9 48.1,40.45 RN1.3
ETH-RST
  Top 0.2: IC1.19 40.25,42.21 C12.1 R19.1
ETH-SHLD  (via drill 0.3)
  Top 1.4: POE-ETH.SH1 C2.1
  other vias: 0.95,26.4 4.15,26.4 6.75,26.4 9.75,26.4 0.95,23.6 0.95,16.2 0.95,12.6 0.95,5 0.95,1 4.35,1 9.75,1 7.15,1 11.15,11.4 9.35,13.6 9.55,19.2 5.95,22.2 7.15,13.6 7.15,11.2 5.95,6.4 4.35,4.8 10.95,26.4 10.95,25 9.75,25 0.75,9 0.75,19.8
  pour Bottom (isolate 0.3, rank 4, no thermals): 0.2,-0.2 12.35,-0.2 12.35,11 9.95,13.4 9.95,20.2 11.55,21.8 11.55,27.2 0.2,27.2
  pour Route15 (isolate 0.3, rank 4, no thermals): 0.2,-0.2 12.35,-0.2 12.35,11 9.95,13.4 9.95,20.2 11.55,21.8 11.55,27.2 0.2,27.2
  pour Route2 (isolate 0.3, rank 4, no thermals): 0.2,-0.2 12.35,-0.2 12.35,11 9.95,13.4 9.95,20.2 11.55,21.8 11.55,27.2 0.2,27.2
  pour Top (isolate 0.3, rank 4, no thermals): 0.2,-0.2 12.35,-0.2 12.35,11 9.95,13.4 9.95,20.2 11.55,21.8 11.55,27.2 0.2,27.2
ETH-TD_N
  Top 0.175: POE-ETH.6 14.46,13.71 14.78,14.03 14.78,14.39 14.33,14.84 12.83,14.84 11.84,15.83 11.84,19.52 19.78,27.46 22.67,27.46 23.62,26.51 24.4,26.51 | 24.4,26.51 28.88,26.51 37.24,34.87 37.24,35.72 38.3,36.78 | R15.1 38.3,36.78 | IC1.28 39.94,37.69 39.94,37.56 39.48,37.11 38.63,37.11 38.3,36.78 | U1.5 24.4,26.51
ETH-TD_P
  Top 0.175: POE-ETH.5 15.9,14.65 14.98,14.65 14.47,15.16 12.97,15.16 12.16,15.97 12.16,19.38 19.92,27.14 21.8,27.14 | 21.8,27.14 22.53,27.14 23.48,26.19 29.02,26.19 37.56,34.73 37.56,35.58 38.53,36.55 | R16.2 38.53,36.55 | IC1.29 40.29,37.33 40.16,37.33 39.62,36.79 38.77,36.79 38.53,36.55 | U1.1 21.8,27.14
ETH-VDDA  (via drill 0.3)
  Top 0.5: R18.1 v39.55,33.6 | 38.28,34.93 v38.25,34.9 38.28,34.93 | R16.1 38.28,34.93 | R15.2 v36.95,36.2 | R17.2 38.28,34.93 | POE-ETH.3 16.24,17.55 C3.1
  Route15 1: POE-ETH.4 14.26,16.25 15.53,17.53 POE-ETH.3 18.35,19.64 18.35,25.8 19.55,27 30.35,27 v38.25,34.9 | v38.25,34.9 v36.95,36.2 | v38.25,34.9 v39.55,33.6
  Bottom 0.2: POE-ETH.13 4.35,11.35 4.35,15.4 5.15,16.2 13.64,16.2 POE-ETH.4
  other vias: 42.1,35.9 39.1,37.7 42.8,35.9 38.6,38.2 42.3,29.8 42.3,30.6 41.5,30.6 40.7,30.6
  pour Top (isolate 0.2, no thermals): 43.2,34.55 43.2,36 42.4,36.8 42,36.8 41.6,36.4 41.6,34.55
  pour Top (isolate 0.2, no thermals): 37.2,38 38.2,37 39,37 40.2,38.2 39.8,38.6 39.65,38.45 38.15,38.45 37.8,38.8 37.2,38.8
  pour Top (isolate 0.2, no thermals): 40.8,31.2 43.4,31.2 43.6,31 43.6,29.45 43.5,29.35 40.65,29.35 40.4,29.6 40.4,30.8
  pour Route15 (isolate 0.4, no thermals): 39.8,29.4 36.4,32.8 36.4,36.8 38,38.4 39,38.4 41,36.4 42.8,36.4 43.2,36 43.2,35 42.6,34.4 42.2,34.4 41.6,33.8 41.6,32.6 42.8,31.4 42.8,29.8 42.4,29.4
ETH-VDDCR  (via drill 0.3)
  Top 0.25: IC1.6 44.86,37.6 v45,37.6
  Top 0.6: C7.1 45.5,37.6 C10.1 v45,37.6
ETH-VDDIO  (via drill 0.3)
  Top 0.25: IC1.12 44.4,41.45
  Top 0.5: 41.8,46.35 v42.2,46.35 42.6,46.35 RN2.7 | RN2.8 41.8,46.35 | 41.8,46.35 40.7,46.35 40.25,45.9 R19.2
  Route2 0.5: v42.2,46.35 42.65,46.35 43.55,45.45 44.75,45.45 45.85,44.35 45.85,43.35 | 45.85,43.35 v45.4,42.9 v45.85,42.45 45.85,43.35
  other vias: 46.5,32.9 47.2,32.9 46.5,32.2 47.2,32.2
  pour Top (isolate 0.2, rank 2, no thermals): 46.25,32.4 46.25,33.8 47,33.8 48,32.8 48,29.35 44.4,29.35 44.3,29.45 44.3,31.05 44.45,31.2 45.05,31.2
  pour Top (isolate 0.2, rank 2, no thermals): 43.4,41.2 43.8,41.6 43.8,42.8 44.95,42.8 45.35,43.2 45.5,43.2 45.9,42.8 48.2,42.8 48.2,42.2 46.8,42.2 44.6,40
  pour Route2 (isolate 0.4, rank 2, no thermals): 45.6,42 44.8,42.8 44.8,45.6 50.8,45.6 51.4,45 51.4,37.6 48.2,34.4 48.2,32.2 47.6,31.6 46.4,31.6 46,32 46,34.4 47.4,35.8 47.4,37.8 48.6,39 48.6,42 48.2,42.4 46.4,42.4 46,42
GND  (via drill 0.3)
  Bottom 0.2: POE-ETH.12 3.52,18.44 5.15,16.8 12.55,16.8
  other vias: 76.2,27 77.6,27 79,27 79,25.6 77.6,25.6 76.2,25.6 76.9,24.9 78.3,24.9 78.3,27.7 78.3,26.3 76.9,26.3 76.9,27.7 13.55,25.8 22.9,25.8 19.6,23.4 20.2,25.8 19.85,19.65 19.5,16.65 15.15,23.8 15.75,28.2 23.15,28.2 49.8,18 46.2,23.8 49,10.4 49,7.8 49.4,5.2 49.2,0.8 52.2,0.8 49.4,2.8 53.4,7.8 57.6,7.8 56,0.8 59.2,6.8 58,3.9 13.7,22.45 80.35,8.25 67.75,15.5 68.35,0.6 85.8,0.8 85.8,34.6 85.8,33 85.9,25.8 85.9,20.1 85.9,15.75 85.9,14.95 65.2,0.6 83.05,14.3 80.2,17.3 68.2,35.4 72,35.45 81.3,31.8 78.2,31.8 77.05,17.3 77.6,19 63.6,32.2 73.7,31.8 15.55,13.8 15.35,19.1 13.7,20.05 77.55,14.3 85.8,33.8 85.2,35 83.4,18.2 74,17.3 64,24.2 68.8,27.6 72,27.6 65.4,27.6 68.8,30 59.6,16.4 62,22.4 67.1,32 67.1,34 58.4,14.6 58,12.6 54.8,14 51.8,16.4 51.4,21 58.7,20.4 63,27.6 59.4,30 66.6,17.1 39.15,42.55 46.55,44.8 41.2,43.2 38.5,39.8 38.5,39.1 42,39.4 43.6,39.4 42,41 40.4,39.4 42,37.8 42.3,33.6 37.6,26.1 46.7,36.75 46.45,38 46.7,35.85 25.75,24.6 36,34.9 39.4,44.75 49.1,24.2 40.6,28.4 49.8,20.1 51,13.3 43.6,32.25 29.8,31.4 29.8,28.45 31.55,24.6 33.2,31.9 33.2,34.6 58,24.8 61.6,24 74.3,29.7 12.75,16.95 17.6,14.85 12.05,14.55 16.95,21.4 44.95,43.9 44.05,43.9 48.45,43.6 43.8,46.35 52.1,24.6 42.2,28.4 41.4,27.8 42.3,32.9 48.8,21.4 43.2,26.2 40.5,32.25 13.55,23.8 15.15,25.8 13.55,24.8 15.15,24.8 29.8,48.8 34,48.8 38.2,48.8 34.2,46.2 33,43.2 21.85,23.3 20.75,21.4 16.95,25.8 19.55,28.2 27.8,29.2 28.55,24.6 25.35,28.2 29.8,44.8 29.8,39.6 29.8,35.4 35.8,37.4 37,43.2 37.8,47.2 35.4,47.6 33,47.8 31.2,44.8 42.8,48.8 47.6,48.8 52,48.8 57.8,48.8 63.8,48.8 69.8,48.8 64,47 64.8,47 58.4,45.2 60.8,43.6 52.2,45 48,47 51.8,47 40.3,47 63.2,47 35.8,39.6 41.05,45.55 37.75,41.15 50.25,41.8 59.4,28.6 55.4,29 54,30.8 51,34 46,35.2 52.2,39.8 53.6,38.4 56.8,35.2 63.2,30 64.8,29.6 36.8,30.9 33.15,26.1 60.8,41.8 55.2,44.4 55.6,41.2 59.2,39.8 63.4,39.8 64.6,37.2 66.8,41.4 68.4,39.2 70.8,42.6 71,46.4 68.8,47.2 66.8,47.2 45.4,32.65 45.8,28.4 47.2,28 46.4,28 44.2,28.4 50.4,28.4 48.9,26.6 85.8,12 84.8,9.6 84.8,4.2 84.8,6.9 83,6.9 82.6,9.6 82.6,4.2 80.6,2.8 81.4,11.2 77.75,7.45 77.75,9.25 80.15,9.25 79.35,7.05 76.95,4.65 74.55,5.6 54.85,21.9 60.05,7.85 61.3,10.75 65.05,9.85 65.05,9.05 68.05,12.25 68.85,12.25 69.25,12.85 69.25,13.65 68.05,14.25 68.85,14.25 65.85,9.85 62.75,10.75 65.05,10.65 66.15,11.7 72.85,5.85 73.65,5.85 75.95,0.6 72.55,0.6 78.75,0.6 82.75,0.6 60.2,0.6 63,0.6 60.2,2.2 60.2,1.4 53.4,9.6 52.4,8.6 63.15,6.15 65,4.2 67.4,3.6 61.4,3.6 63.6,1.6 72.85,6.65 78.7,10.9 77.05,12.6 80.65,13.05 52.4,32.6 59.8,32.2 61.6,26.8 50.2,10.4 50.2,9 50.2,7.8 53.4,13.3 55.2,12.3 56.8,10.7 52.2,10.6 49.8,14.3 68.8,20.4 72.4,20.4 74.8,20 81,18.6 69.6,47.2 72.75,12.35 70.95,14.15 70.95,11.35 74.1,10.9 85.9,16.55 54,40 60.6,34 57.6,37 67.35,36.8 69.55,37.2 74,35.85 76.9,29.7 79.7,30.7 73.7,26.5 68.8,23.6 68.8,26.2 65.3,22.7 83,31.35 75.8,35.85 71,37.25 69.6,41.05 72.45,42.9 72.4,37.25 73.2,44.25 77.8,44.25 80.4,46.25 80.4,44.65 75.4,48.8 80.4,48.8 85.6,48.8 85.9,39.2 85.9,44 75.8,37.65 76.2,41.85 74.6,41.25 71,40.85 77,38.55 78.2,39.75 77.7,36.6 58.4,22.8 67.75,16.95 57.1,20 54.5,19.4 53.7,27.4 52.5,28.8 50.9,26.4 63.15,16.8 65.85,10.65
  pour Top (isolate 0.2, rank 6, no thermals): 29.4,49.4 29.4,31.4 26.4,28.4 15.55,28.4 8.95,21.8 0.2,21.8 0.2,-0.2 86.4,-0.4 86.4,49.4
  pour Bottom (isolate 0.2, rank 6, no thermals): 29.4,49.4 29.4,31.4 26.4,28.4 15.55,28.4 8.95,21.8 0.2,21.8 0.2,-0.2 86.4,-0.4 86.4,49.4
  pour Route2 (isolate 0.4, rank 6, no thermals): 29.4,49.4 29.4,31.4 26.4,28.4 15.55,28.4 8.95,21.8 0.2,21.8 0.2,-0.2 86.4,-0.2 86.4,49.4
  pour Route15 (isolate 0.4, rank 6, no thermals): 29.4,49.4 29.4,31.4 26.4,28.4 15.55,28.4 8.95,21.8 0.2,21.8 0.2,-0.2 86.4,-0.2 86.4,49.4
  cutout Top (isolate 0.2, rank 2, no thermals): 16.55,13 20.45,16.9 20.45,20.3 24.15,24 31.75,24 33.35,25.6 43.6,25.6 49.2,20 49.2,14.4 48.4,13.6 48.4,0.2 48.2,0.2 48.2,13.8 49,14.6 49,19.8 43.4,25.4 33.55,25.4 31.95,23.8 24.35,23.8 20.65,20.1 20.65,16.7 16.75,12.8 12.95,10.8 11.75,9.6 11.75,0 11.55,0 11.55,9.8 12.75,11
  cutout Bottom (isolate 0.2, rank 2, no thermals): 16.55,13 20.45,16.9 20.45,20.3 24.15,24 31.75,24 33.35,25.6 43.6,25.6 49.2,20 49.2,14.4 48.4,13.6 48.4,0.2 48.2,0.2 48.2,13.8 49,14.6 49,19.8 43.4,25.4 33.55,25.4 31.95,23.8 24.35,23.8 20.65,20.1 20.65,16.7 16.75,12.8 12.95,10.8 11.75,9.6 11.75,0 11.55,0 11.55,9.8 12.75,11
  cutout Route15 (isolate 0.2, rank 2, no thermals): 16.55,13 20.45,16.9 20.45,20.3 24.15,24 31.75,24 33.35,25.6 43.6,25.6 49.2,20 49.2,14.4 48.4,13.6 48.4,0.2 48.2,0.2 48.2,13.8 49,14.6 49,19.8 43.4,25.4 33.55,25.4 31.95,23.8 24.35,23.8 20.65,20.1 20.65,16.7 16.75,12.8 12.95,10.8 11.75,9.6 11.75,0 11.55,0 11.55,9.8 12.75,11
  cutout Route2 (isolate 0.2, rank 2, no thermals): 16.55,13 20.45,16.9 20.45,20.3 24.15,24 31.75,24 33.35,25.6 43.6,25.6 49.2,20 49.2,14.4 48.4,13.6 48.4,0.2 48.2,0.2 48.2,13.8 49,14.6 49,19.8 43.4,25.4 33.55,25.4 31.95,23.8 24.35,23.8 20.65,20.1 20.65,16.7 16.75,12.8 12.95,10.8 11.75,9.6 11.75,0 11.55,0 11.55,9.8 12.75,11
PHY-PWR
  Top 0.2: R14.1 52.25,27.25 55.6,30.6 64.2,30.6 66.6,33 68.8,33 ESP1.14
POE-5V0
  pour Top (isolate 0.3, no thermals): 40.05,17.3 29.75,17.3 29.75,20.8 34.35,20.8 35.35,21.8 39.15,21.8 40.15,20.8 42.6,20.8 46.2,17.2 46.2,11.2 43.2,11.2 42.3,10.4 42.3,5.6 41.95,5.25 41.3,5.25 40.75,5.8 40.75,12.4 40.5,12.4 40.25,12.15 40.25,11.1 39.8,11.1 39.8,12.8 40,13 40.75,13 40.75,16.6
POE-CLASS
  Top 0.4: IC2.2 36,2.45 37.6,2.45 R27.1
POE-DC-BS
  Top 0.4: IC3.8 37.5,10.81 37.5,12 R39.1
POE-DC-BS-RC
  Top 0.4: R39.2 C17.1
POE-DC-FB
  Top 0.4: IC3.5 38.15,7 38.85,7.7 R37.1 R36.1 C19.2
POE-DC-FBRT
  Top 0.4: R36.2 39,11.3 39,12.5 R38.2
POE-DC-ILIM  (via drill 0.3)
  other vias: 33.15,9.6 33.15,10.6 34.35,10.6 35.55,10.6 35.55,9.6 35.55,7.2 33.15,7.2 33.15,8.2 34.35,9.6 34.35,8.2 34.35,7.2 35.55,8.2
  pour Top (isolate 0.3, no thermals): 28.45,11 30.3,11 30.3,10 32.55,10 32.75,10.2 32.75,10.8 32.95,11 35.75,11 35.95,10.8 35.95,7 35.75,6.8 32.95,6.8 32.75,7 32.75,9 32.55,9.2 28.45,9.2
  pour Bottom (isolate 0.2, no thermals): 37.15,7 37.15,10.8 36.95,11 31.15,11 30.95,10.8 30.95,7 31.15,6.8 36.95,6.8
  pour Route15 (isolate 0.2, no thermals): 32.75,10.8 32.95,11 35.75,11 35.95,10.8 35.95,7.2 35.75,7 32.95,7 32.75,7.2
  pour Route2 (isolate 0.2, no thermals): 32.75,10.8 32.95,11 35.75,11 35.95,10.8 35.95,7.2 35.75,7 32.95,7 32.75,7.2
POE-DC-SW
  pour Top (isolate 0.3, rank 2, no thermals): 29.75,16.4 29.75,10 34.35,10 34.35,13 34.75,13.4 38.55,13.4 38.95,13.8 38.95,16.2 38.75,16.4
POE-DET
  Top 0.4: IC2.3 36,3.65 R25.2
POE-GND  (via drill 0.3)
  other vias: 26.15,11.2 26.95,11.2 27.75,11.2 27.75,10.4 27.75,9.6 21.75,13 21.75,12.2 23.35,12.2 21.75,11.4 23.35,11.4 24.55,17.6 25.75,17.6 26.95,17.6 26.95,20.6 25.95,20.6 24.95,20.6 26.95,19 24.55,19 20.95,12.2 28.95,15.2 28.95,14.4 28.95,17.6 28.95,20.6 46,7.8 45.8,4.6 30.95,6.15 38.65,6.3 45.8,0.8 43.2,0.6 40.55,0.6 40.55,3.6 42.2,3.6 43.4,10 27.95,12.8 27.75,12 27.15,12.8 26.15,12.8 27.15,16 27.95,16 28.95,16 28.95,13.6 28.95,12.8 26.15,14.4 26.15,13.6 26.15,10.4 24.15,12.2 23.35,13 44.8,7.8 44.8,10 46,10 31.65,6.15 32.35,6.15 31.05,5.5 30.35,5.5 31.7,5.5 26.15,9.6 26.15,15.2 26.15,16 23.35,15.2 23.55,19 44,20.4 45.8,18.6 31.1,4.85
  pour Top (isolate 0.2, rank 3, no thermals): 21.15,9.6 20.15,10.6 20.15,12.5 23.05,15.4 23.05,19.1 24.75,20.8 34.35,20.8 35.35,21.8 39.15,21.8 40.15,20.8 44.2,20.8 46.2,18.8 46.2,0.1 40.15,0.1 40.15,4.4 37.75,6.8 33.35,6.8 31.15,4.6 29.55,4.6 29.55,5.6 25.55,9.6
  pour Bottom (isolate 0.2, rank 3, no thermals): 21.15,9.6 20.15,10.6 20.15,12.5 23.05,15.4 23.05,19.1 24.75,20.8 34.35,20.8 35.35,21.8 39.15,21.8 40.15,20.8 44.2,20.8 46.2,18.8 46.2,0.1 40.15,0.1 40.15,4.4 37.55,7 33.55,7 31.15,4.6 29.55,4.6 29.55,5.6 25.55,9.6
  pour Route2 (isolate 0.4, rank 3, no thermals): 21.15,9.6 20.15,10.6 20.15,12.5 23.05,15.4 23.05,19.1 24.75,20.8 34.35,20.8 35.35,21.8 39.15,21.8 40.15,20.8 44.2,20.8 46.2,18.8 46.2,0.1 40.15,0.1 40.15,4.4 37.55,7 33.55,7 31.15,4.6 29.55,4.6 29.55,5.6 25.55,9.6
  pour Route15 (isolate 0.4, rank 3, no thermals): 21.15,9.6 20.15,10.6 20.15,12.5 23.05,15.4 23.05,19.1 24.75,20.8 34.35,20.8 35.35,21.8 39.15,21.8 40.15,20.8 44.2,20.8 46.2,18.8 46.2,0.1 40.15,0.1 40.15,4.4 37.55,7 33.55,7 31.15,4.6 29.55,4.6 29.55,5.6 25.55,9.6
POE-ILIM
  Top 0.4: IC2.1 36.84,1.09 37.1,1.35 R26.1
POE-PG  (via drill 0.3)
  Top 0.3: IC2.6 30.3,3.7 31.1,3.7 v31.25,3.85
  Top 0.4: v37.85,8.25 IC3.6
  Bottom 0.3: v31.25,3.85 31.3,3.85 33.75,6.3 37.05,6.3 37.85,7.1 v37.85,8.25
POE-UVLO
  Top 0.3: IC2.7 30.3,2.4 R24.2 R23.1
POE-V+  (via drill 0.3)
  Top 0.4: R25.1 38.5,3.65 v38.5,4.15
  Bottom 0.4: v38.5,4.15 38.5,1.15 37.9,0.55 29.3,0.55 v29.1,0.75
  pour Top (isolate 0.3, rank 2, no thermals): 15.55,10.7 15.95,11.1 18.95,11.1 20.95,9.1 25.05,9.1 25.45,8.7 32.15,8.7 32.15,7.8 30.55,7.8 30.35,7.6 30.35,6.6 29.15,5.4 29.15,3.85 31.15,3.85 31.15,0.1 20.35,0.1 19.15,1.3 19.15,3.6 15.55,7.2
POE-V-  (via drill 0.3)
  Top 0.3: R23.2 v28.7,5
  Top 0.4: R26.2 R27.2
  other vias: 35.4,5.4 36.2,5.4 37,5.4 34.6,5.4 23.1,0.6 24.5,0.6 24.5,1.4 23.1,1.4 34.6,4.6 34.6,3.8 34.6,3 34.6,2.2 34.6,1.4 15.7,2.8 15.7,2 15.7,1.2 17.9,2.8 17.9,2 17.9,1.2 16.3,0.6 17.1,0.6 33.1,1.4 33.85,1.4 33.1,4.6 33.85,4.6 32.35,1.4 13.5,0.8 13.5,3.4 14.1,6.4 16.5,5.2
  pour Bottom (isolate 0.3, rank 2, no thermals): 12.95,9.1 13.55,9.7 14.65,9.7 16.55,7.8 26.35,7.8 28.95,5.2 28.95,4 31.55,4 33.35,5.8 37.35,5.8 38.75,4.4 38.75,0.1 12.95,0.1
  pour Top (isolate 0.2, no thermals): 22.75,0 22.75,1.55 22.95,1.75 24.65,1.75 24.85,1.55 24.85,0
  pour Top (isolate 0.2, no thermals): 39.45,0 32.15,0 32.15,4.55 33.35,5.75 37.85,5.75 39.45,4.15
  pour Route15 (isolate 0.3, rank 2, no thermals): 12.95,9.1 13.55,9.7 14.65,9.7 16.55,7.8 26.35,7.8 28.95,5.2 28.95,4 32.55,4 34.35,5.8 37.35,5.8 38.75,4.4 38.75,0.1 12.95,0.1
  pour Route2 (isolate 0.3, rank 2, no thermals): 12.95,9.1 13.55,9.7 14.65,9.7 16.55,7.8 26.35,7.8 28.95,5.2 28.95,4 32.55,4 34.35,5.8 37.35,5.8 38.75,4.4 38.75,0.1 12.95,0.1
  pour Top (isolate 0.3, rank 3, no thermals): 12.95,9.1 13.55,9.7 14.65,9.7 16.55,7.8 26.35,7.8 28.95,5.2 28.95,4 32.55,4 34.35,5.8 37.35,5.8 38.75,4.4 38.75,0.1 12.95,0.1
PWR-LED
  Top 0.4: PGD.A R48.1
PWR-SNS
  Top 0.2: ESP1.5 80.23,34.77 79.8,35.2 78.9,35.2 78.4,35.7 76.9,35.7 R43.2 R44.1 C27.1
RXD-B
  Top 0.2: OK1.6 31.7,37.4 R4.2
SD-DAT0
  Top 0.2: USD.7 62,41.8 62.4,41.4 64.4,41.4 65,40.8 65,40 65.2,39.8 R31.2
SD-DAT1
  Top 0.2: USD.8 63.1,43.1 63.4,43.4 65,43.4 65.4,43 RN3.3
SD-DAT2
  Top 0.2: USD.1 55.4,43.6 56.4,44.6 62.6,44.6 63,44.2 65,44.2 65.4,44.6 RN3.1
SD-DAT3
  Top 0.2: USD.2 56.5,43.7 57,44.2 62.4,44.2 62.8,43.8 RN3.2
SD-SCLK
  Top 0.2: USD.5 59.8,41.6 60.4,41 64.2,41 64.6,40.6 64.6,38.8 64.8,38.6 R33.2
SD-VCC  (via drill 0.3)
  Route15 1: v58.7,41.85 v58.7,43.6 60.9,45.8 v65.3,45.8 v66.9,45.8 v68.7,45.8
  pour Top (isolate 0.2, rank 2, no thermals): 70.2,45.2 70.4,45.4 70.4,46.2 70.2,46.4 65.2,46.4 65,46.2 65,45.6 65.4,45.2
  pour Top (isolate 0.2, rank 2, no thermals): 59.2,43.8 59,44 58.4,44 58.2,43.8 58.2,41.6 58.4,41.4 59,41.4 59.2,41.6
TVS-BSB-
  Top 0.3: R9.2 10.2,38.55 D3.1 13.65,38.3 D2.C
TXD-A
  Top 0.2: OK2.1 33.26,42.26 33.85,42.85 R3.2
TXD-B
  Top 0.2: Q2.B 33.9,41.3 34.4,41.8 35.4,41.8 35.8,42.2 35.8,44.25 R6.1
TXD-C
  Top 0.2: Q2.C R3.1
UEXT-RX  (via drill 0.3)
  Top 0.2: v61.2,27.6 61,27.4 61,24.8 59.6,23.4 56.33,23.4 UEXT.4 55.53,22.6 54.6,22.6 54.3,22.3 52.9,22.3 52.6,22 52.6,19.4 52.2,19 52.2,17.6 53,16.8 54.2,16.8 54.8,16.2 54.8,15 55.6,14.2 57,14.2 57.8,15 57.8,15.6 59.2,17 60,17 60.2,16.8 RN4.4 | ESP1.7 77.69,33.09 76.4,31.8 v75.4,31.8
  Bottom 0.2: v75.4,31.8 75.2,31.8 71.8,28.4 61.4,28.4 61.2,28.2 v61.2,27.6
UEXT-TX  (via drill 0.3)
  Top 0.2: ESP1.9 75.15,32.8 v74.85,32.5 | UEXT.3 54.74,23.34 55.8,24.4 56.6,24.4 57.2,23.8 59.4,23.8 60.6,25 v60.6,28
  Bottom 0.2: v74.85,32.5 74.85,32.05 71.6,28.8 61.2,28.8 60.8,28.4 60.8,28.2 v60.6,28
USB-D_N
  Top 0.175: USB.D- 80.95,6.25 80.8,6.4 80.05,6.4 79.07,5.42 77.13,5.42 76.62,5.93 76.62,6.55 | 76.62,6.55 76.62,8.07 77.18,8.62 78.35,8.62 78.42,8.7 IC6.2 | U2.1 76.62,6.55
  Top 0.2: USB.D- 81.9,6.25
USB-D_P
  Top 0.175: USB.D+ 80.95,6.9 80.8,6.75 79.9,6.75 78.93,5.77 77.27,5.77 76.97,6.07 76.97,6.55 | 76.97,6.55 76.97,7.93 77.32,8.28 78.35,8.28 78.42,8.2 IC6.1 | U2.5 76.97,6.55
USB-VBUS
  Top 0.4: USB.VBUS 80.3,5.6 80.3,5.4
  Top 0.8: 80.3,5.4 79.5,4.6 Q7.3

## Text on the board
tPlace: B+ | B- | T Carpenter V1.1 Apr25 | github://TCWORLD/BSB-Interface-PCBs | Open / Hardware | BSB to PoE-LAN / ESP32 Based | (w/o UART) | Isolated / Supply
bPlace: Based on designs from: / Olimex ESP32-POE-ISO / Fredlcore BSB-LAN | JLCJLCJLC